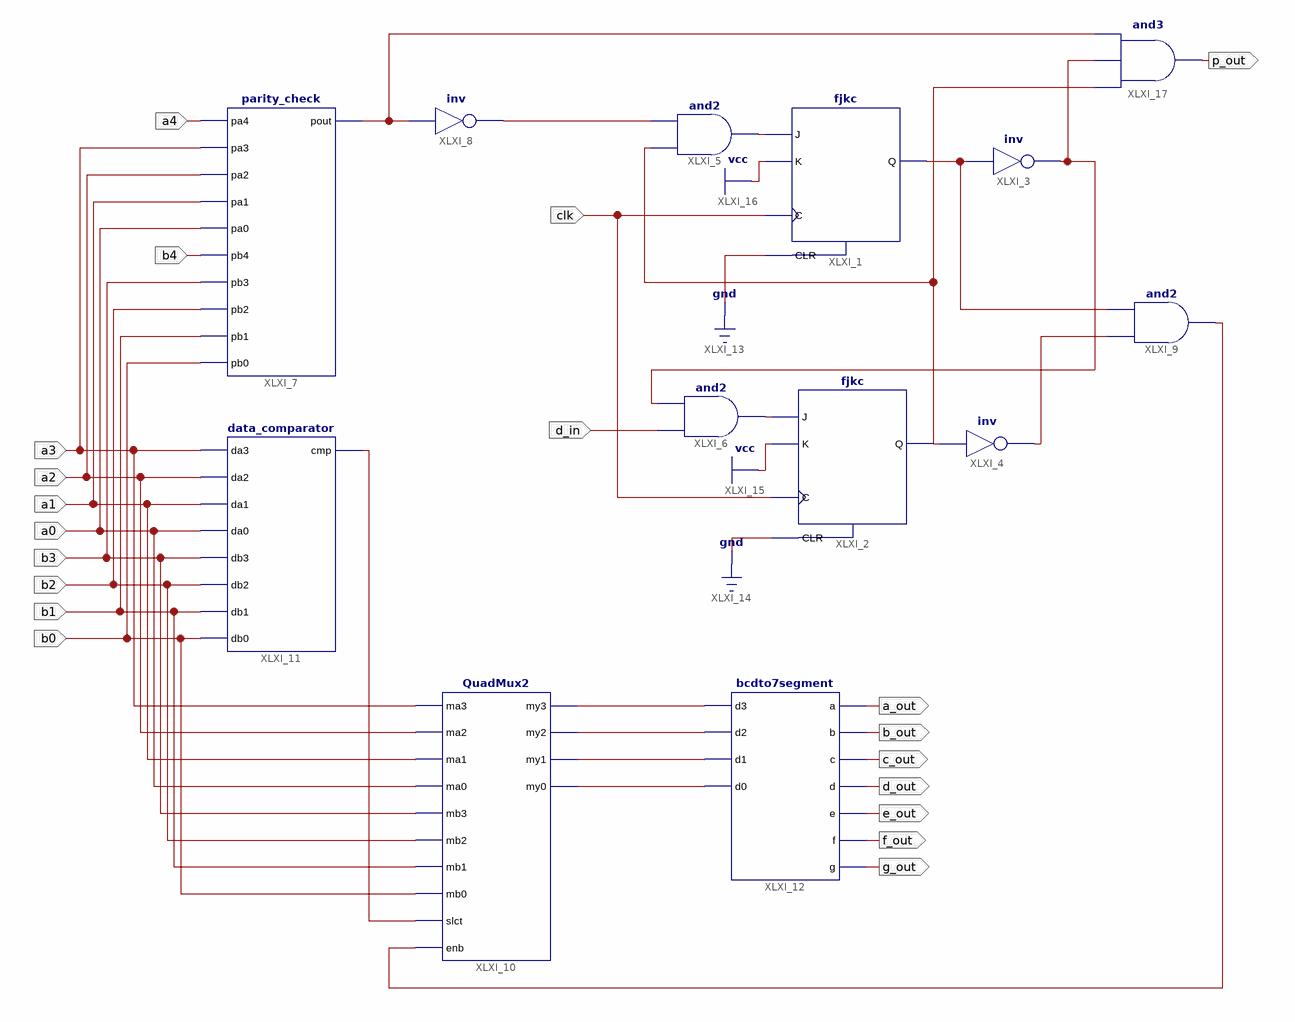
[diagram p0: schematic sheet 1]
// Xilinx ISE schematic ff.sch (xc9500xl) as structural Verilog: 13 symbols, 20 ports
module ff (
  input  d_in,
  input  a3,
  input  a2,
  input  a1,
  input  a0,
  input  b3,
  input  b2,
  input  b1,
  input  b0,
  input  a4,
  input  b4,
  input  clk,
  output a_out,
  output b_out,
  output c_out,
  output d_out,
  output e_out,
  output f_out,
  output g_out,
  output p_out
);

  wire XLXN_1, XLXN_3, XLXN_4, XLXN_6, XLXN_8, XLXN_31, XLXN_38, XLXN_79, XLXN_80, XLXN_81, XLXN_82, XLXN_83,
       XLXN_155, XLXN_158;

  parity_check XLXI_7 (
    .pa0(a0), .pa1(a1), .pa2(a2), .pa3(a3), .pa4(a4), .pb0(b0), .pb1(b1), .pb2(b2), .pb3(b3), .pb4(b4),
    .pout(XLXN_155));
  not XLXI_8 (XLXN_8, XLXN_155);
  QuadMux2 XLXI_10 (
    .enb(XLXN_79), .ma0(a0), .ma1(a1), .ma2(a2), .ma3(a3), .mb0(b0), .mb1(b1), .mb2(b2), .mb3(b3),
    .my0(XLXN_83), .my1(XLXN_82), .my2(XLXN_81), .my3(XLXN_80), .slct(XLXN_38));
  data_comparator XLXI_11 (
    .cmp(XLXN_38), .da0(a0), .da1(a1), .da2(a2), .da3(a3), .db0(b0), .db1(b1), .db2(b2), .db3(b3));
  fjkc XLXI_1 (.C(clk), .CLR(1'b0), .J(XLXN_3), .K(1'b1), .Q(XLXN_1));
  and XLXI_5 (XLXN_3, XLXN_6, XLXN_8);
  not XLXI_4 (XLXN_31, XLXN_6);
  fjkc XLXI_2 (.C(clk), .CLR(1'b0), .J(XLXN_4), .K(1'b1), .Q(XLXN_6));
  and XLXI_6 (XLXN_4, d_in, XLXN_158);
  and XLXI_9 (XLXN_79, XLXN_31, XLXN_1);
  not XLXI_3 (XLXN_158, XLXN_1);
  bcdto7segment XLXI_12 (
    .a(a_out), .b(b_out), .c(c_out), .d(d_out), .d0(XLXN_83), .d1(XLXN_82), .d2(XLXN_81), .d3(XLXN_80),
    .e(e_out), .f(f_out), .g(g_out));
  and XLXI_17 (p_out, XLXN_6, XLXN_158, XLXN_155);
endmodule
